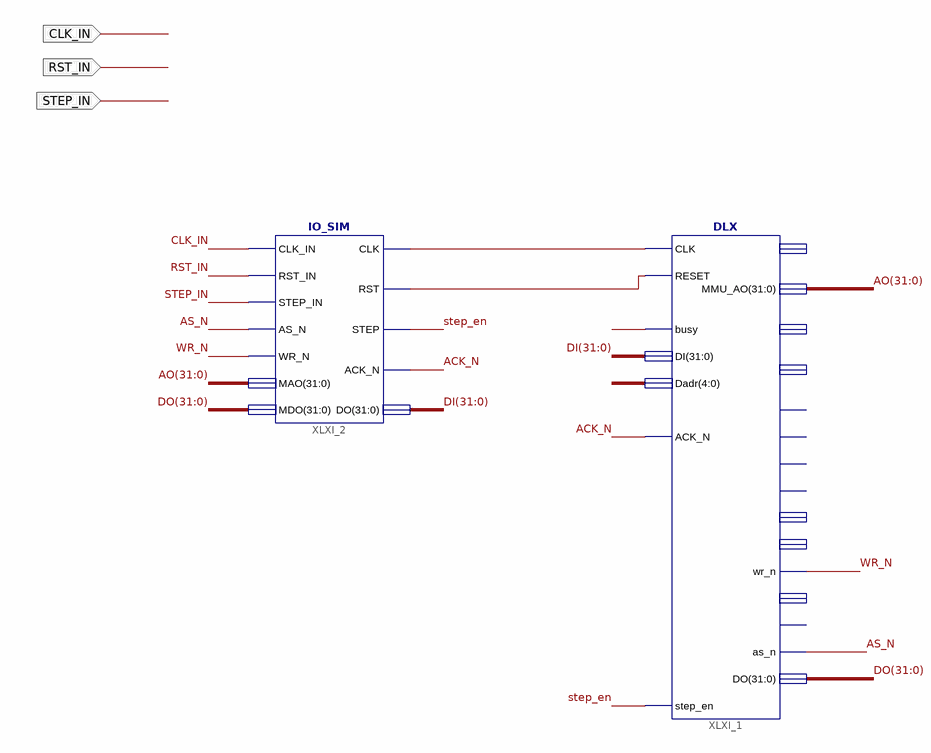
[diagram p0: schematic sheet 1]
// Xilinx ISE schematic DLX_IOSIMUL.sch (spartan6) as structural Verilog: 2 symbols, 3 ports
module DLX_IOSIMUL (
  input  CLK_IN,
  input  RST_IN,
  input  STEP_IN
);

  wire ACK_N, AS_N, step_en, WR_N, XLXN_13, XLXN_14, XLXN_36;
  wire [4:0] XLXN_38;
  wire [31:0] AO, DI, DO;

  DLX XLXI_1 (
    .CLK(XLXN_13), .RESET(XLXN_14), .DI(DI), .Dadr(XLXN_38), .step_en(step_en), .ACK_N(ACK_N), .MMU_AO(AO),
    .busy(XLXN_36), .wr_n(WR_N), .as_n(AS_N), .DO(DO));  // open: func, D, opcode, Itype, jlink, init, halt, ALUF, DLX_STATE, MAC_STATE, stop_n
  IO_SIM XLXI_2 (
    .CLK_IN(CLK_IN), .RST_IN(RST_IN), .STEP_IN(STEP_IN), .AS_N(AS_N), .WR_N(WR_N), .MAO(AO), .MDO(DO),
    .CLK(XLXN_13), .RST(XLXN_14), .STEP(step_en), .ACK_N(ACK_N), .DO(DI));
endmodule
